# EAGLE schematic power (EAGLE 6.2)
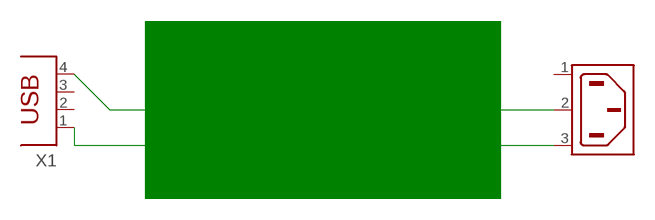
[diagram p0: schematic, sheet 1]

## Parts
X1  PN87520  [PN87520]
X2  6ESRM-P  [6ESRM-P]

## Nets
N$1: X1.4 X2.2(SH)
N$2: X1.1 X2.3(AC2)
Unconnected: X1.2 X1.3 X2.1(AC1)

## Notes on the sheet
- SLUGS TECH CORPORATION
- LIMITED CONFIDENTIAL

## Library data of the parts
X1 = con-berg:PN87520: BERG USB connector; OC_FARNELL: unknown; OC_NEWARK: unknown
X2 = con-tycoelectronics:6ESRM-P: AC Connector 120/250 VAC Source: http://catalog.tycoelectronics.com .. ENG_DS_1654001_1099_SR_0406.pdf; MF: TYCO ELECTRONICS; MPN: 6ESRM-P; OC_FARNELL: unknown; OC_NEWARK: 87F1821